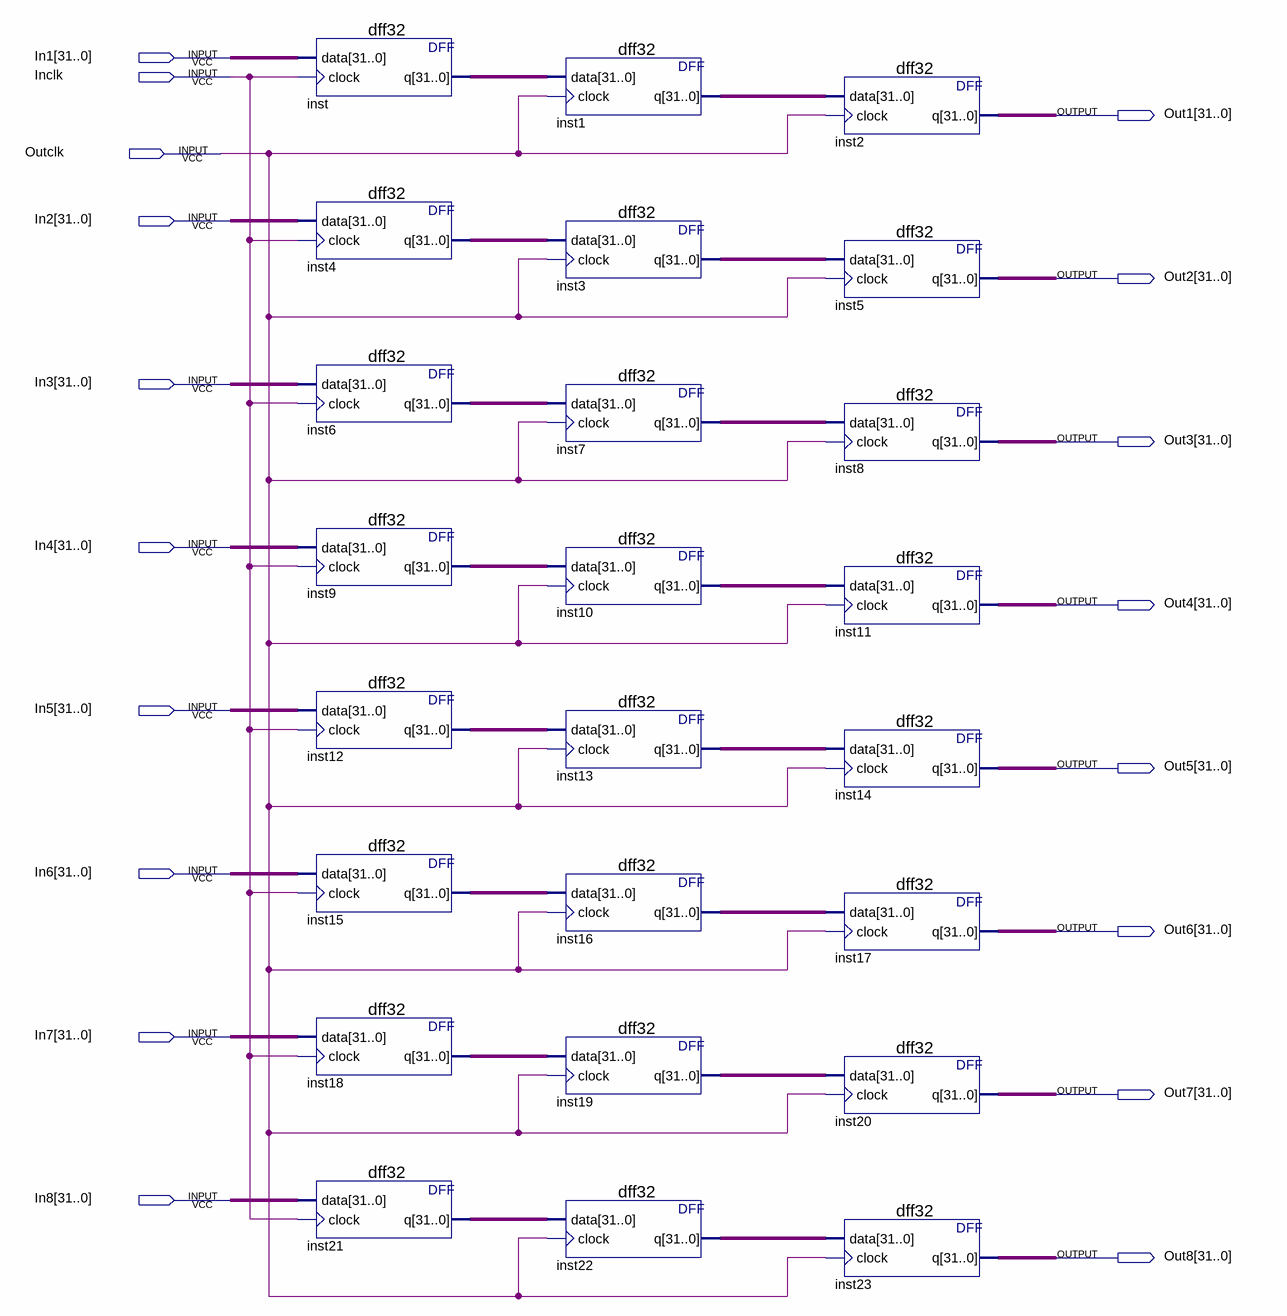
[diagram p0: schematic sheet]
// Quartus schematic synch.bdf as structural Verilog: 24 symbols, 18 pins
module synch (
  input  [31:0] In1,
  input  Inclk,
  input  Outclk,
  input  [31:0] In2,
  input  [31:0] In3,
  input  [31:0] In4,
  input  [31:0] In5,
  input  [31:0] In6,
  input  [31:0] In7,
  input  [31:0] In8,
  output [31:0] Out1,
  output [31:0] Out2,
  output [31:0] Out3,
  output [31:0] Out4,
  output [31:0] Out5,
  output [31:0] Out6,
  output [31:0] Out7,
  output [31:0] Out8
);

  wire [31:0] inst1_q, inst3_q, inst4_q, inst6_q, inst7_q, inst9_q, inst10_q, inst12_q, inst13_q, inst15_q,
       inst16_q, inst18_q, inst19_q, inst21_q, inst22_q, inst_q;

  dff32 inst (.data(In1), .clock(Inclk), .q(inst_q));
  dff32 inst4 (.data(In2), .clock(Inclk), .q(inst4_q));
  dff32 inst6 (.data(In3), .clock(Inclk), .q(inst6_q));
  dff32 inst9 (.data(In4), .clock(Inclk), .q(inst9_q));
  dff32 inst12 (.data(In5), .clock(Inclk), .q(inst12_q));
  dff32 inst15 (.data(In6), .clock(Inclk), .q(inst15_q));
  dff32 inst18 (.data(In7), .clock(Inclk), .q(inst18_q));
  dff32 inst21 (.data(In8), .clock(Inclk), .q(inst21_q));
  dff32 inst1 (.data(inst_q), .clock(Outclk), .q(inst1_q));
  dff32 inst3 (.data(inst4_q), .clock(Outclk), .q(inst3_q));
  dff32 inst7 (.data(inst6_q), .clock(Outclk), .q(inst7_q));
  dff32 inst10 (.data(inst9_q), .clock(Outclk), .q(inst10_q));
  dff32 inst13 (.data(inst12_q), .clock(Outclk), .q(inst13_q));
  dff32 inst16 (.data(inst15_q), .clock(Outclk), .q(inst16_q));
  dff32 inst19 (.data(inst18_q), .clock(Outclk), .q(inst19_q));
  dff32 inst22 (.data(inst21_q), .clock(Outclk), .q(inst22_q));
  dff32 inst2 (.data(inst1_q), .clock(Outclk), .q(Out1));
  dff32 inst5 (.data(inst3_q), .clock(Outclk), .q(Out2));
  dff32 inst8 (.data(inst7_q), .clock(Outclk), .q(Out3));
  dff32 inst11 (.data(inst10_q), .clock(Outclk), .q(Out4));
  dff32 inst14 (.data(inst13_q), .clock(Outclk), .q(Out5));
  dff32 inst17 (.data(inst16_q), .clock(Outclk), .q(Out6));
  dff32 inst20 (.data(inst19_q), .clock(Outclk), .q(Out7));
  dff32 inst23 (.data(inst22_q), .clock(Outclk), .q(Out8));
endmodule
